# Altium schematic sheet 3_power.SchDoc
size A4; SheetNumber: 1; SheetTotal: 1
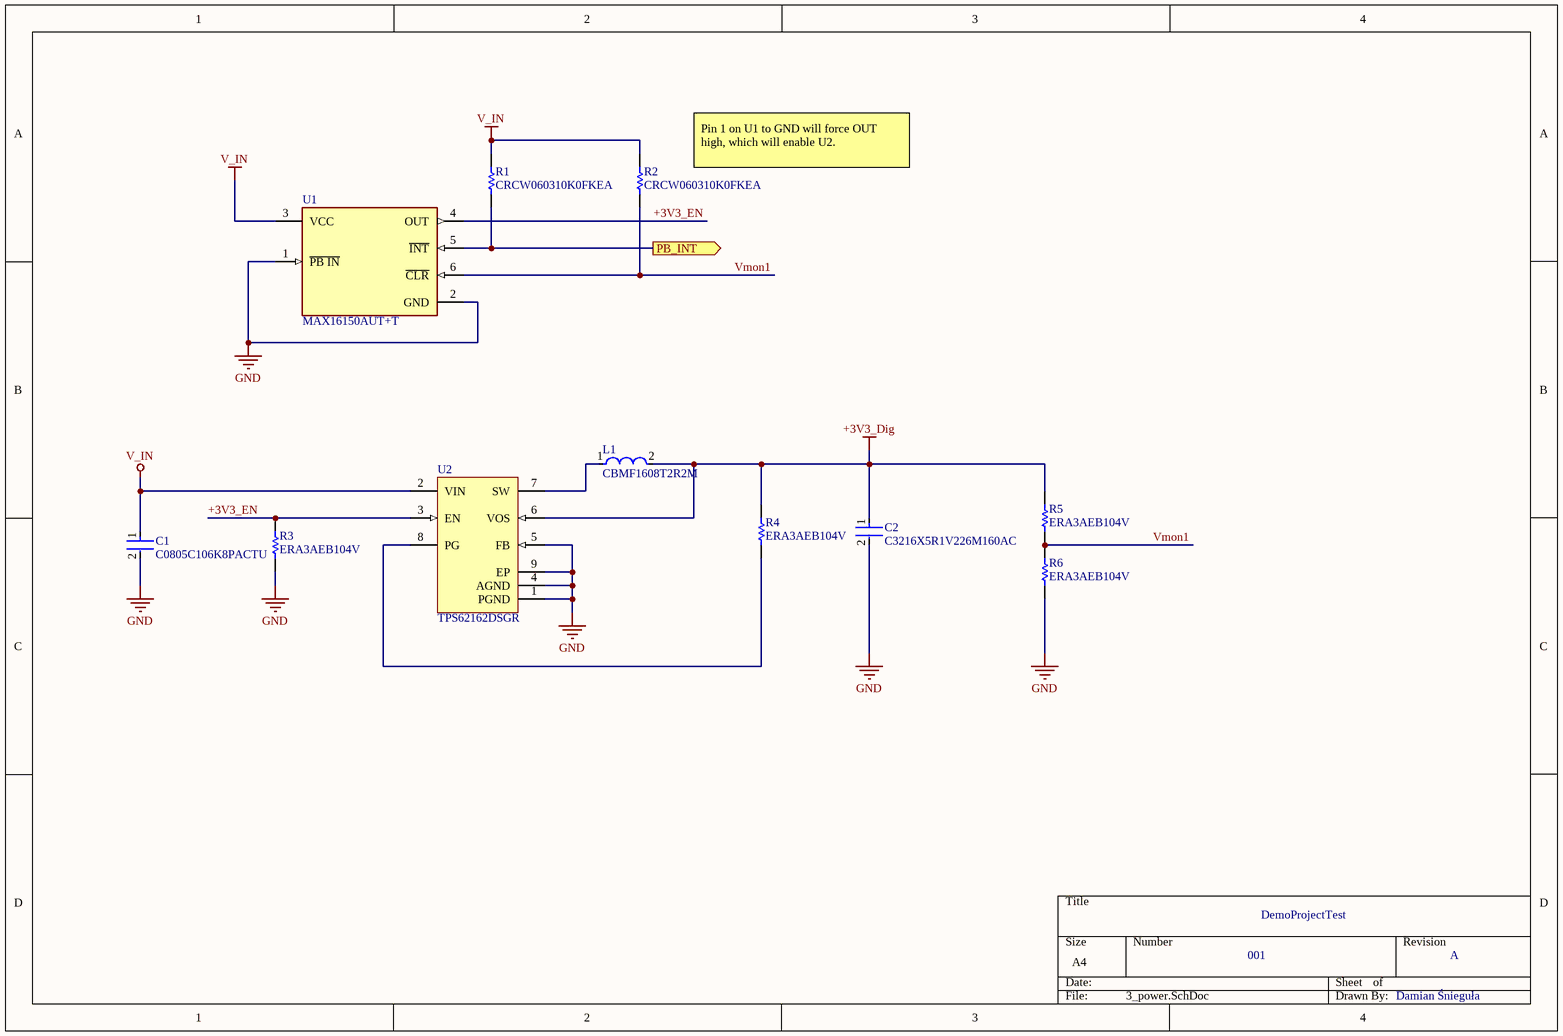
[diagram p0: 3_power.SchDoc]

## Parts
C1  C0805C106K8PACTU  [FP-C0805C-DG-MFG]
C2  C3216X5R1V226M160AC  [FP-C3216-160-0_2-IPC_B]
L1  CBMF1608T2R2M  [FP-CBMF1608-MFG]
R1  CRCW060310K0FKEA  [RESC1609X50X30NL8T20]
R2  CRCW060310K0FKEA  [RESC1609X50X30NL8T20]
R3  ERA3AEB104V  [RESC1608X55X30ML20T20]
R4  ERA3AEB104V  [RESC1608X55X30ML20T20]
R5  ERA3AEB104V  [RESC1608X55X30ML20T20]
R6  ERA3AEB104V  [RESC1608X55X30ML20T20]
U1  MAX16150AUT+T  [FP-U6-1-MFG]
U2  TPS62162DSGR  [DSG0008A_V]

## Ports
PB_INT (out)

## Nets
+3V3_Dig: C2.1 L1.2 R4.2 R5.2 U2.6(VOS)
GND: C1.2 C2.2 R3.1 R6.1 U1.1(~{PB_IN}) U1.2(GND) U2.1(PGND) U2.4(AGND) U2.5(FB) U2.9(EP)
V_IN: C1.1 R1.2 R2.2 U1.3(VCC) U2.2(VIN)
+3V3_EN: R3.2 U1.4(OUT) U2.3(EN)
PB_INT: R1.1 U1.5(~{INT}) ; port PB_INT
Vmon1: R2.1 R5.1 R6.2 U1.6(~{CLR})
NetL1_1: L1.1 U2.7(SW)
NetR4_1: R4.1 U2.8(PG)

## Notes on the sheet
- Pin 1 on U1 to GND will force OUT high, which will enable U2.
- DemoProjectTest
- 001
- A
- Damian Śnieguła

## Library data of the parts
C1 = CMP-2007-03243-2: CAP CER 10UF 10V X5R 0805; Manufacturer: Kemet; 3DS Part Number: 220-00001; Tolerance: 10%; Description: SMD Comm X5R, Ceramic, 10 uF, 10%, 10 V, X5R, SMD, MLCC, Temperature Stable, Class II, 0805; Temperature Coefficient: 15%; Material: Ceramic; Device Class L2: Capacitors; Device Class L1: Passive Components; ComponentLink2URL: https://content.kemet.com/datasheets/KEM_C1006_X5R_SMD.pdf; Height: 1.4mm; Lead Free: Yes; Manufacturer Part Number: C0805C106K8PACTU; Digikey Description: CAP CER 10UF 10V X5R 0805; Octopart: https://octopart.com/c0805c106k8pactu-kemet-98697; Capacitance: 10uF; Value: 10uF; Temperature Range Low: -55°C; Temperature: -55°C to +85°C; Automotive: No; Mouser Description: CAP CER 10UF 10V X5R 0805; Ipc Land Pattern Name: CAPC200125X125; Temperature Range High: +85°C; Voltage: 10V; RoHS: TRUE; Device Class L3: Ceramic Capacitors; ComponentLink2Description: Datasheet; Voltage Rating: 10V; Package: C0805C-DG; Temperature Characteristic: X5R; Category: Cap
C2 = CMP-2000-05398-2: Multilayer Ceramic Capacitors 22uF ±20% 35V X5R SMD 1206; Mount: Surface Mount; Voltage Rating: 35V; Length: 3.2mm; Case/Package: 1206; Width: 0.063inch; Dielectric Material: Ceramic; Series: C; Voltage Rating (DC): 35V; Construction: Flat; Tolerance: 20%; Dielectric: X5R; Voltage: 35V; Min Operating Temperature: -55°C; Case Code (Metric): 3216; Termination: SMD/SMT; Capacitance: 22uF; Resistor Type: Ceramic; RoHS Compliant: Yes; Height: 1.6mm; Depth: 1.6mm; Radiation Hardening: No; Package Quantity: 2000; REACH SVHC: No SVHC; Case Code (Imperial): 1206; Weight: 0.000571oz; Max Operating Temperature: 85°C; Packaging: Tape and Reel; Thickness: 1.6mm; Lead Free: Lead Free
L1 = CMP-14484-000379-1: SMD Inductors 2.2uH ±20% 0.56A 0.221Ω 0603; Core Material: Ferrite; Shielding: Unshielded; DC Resistance (DCR): 221mR; Current Rating: 560mA; Test Frequency: 7.96MHz; Saturation Current: 190mA; Self Resonant Frequency: 80MHz; Packaging: Tape and Reel; Tolerance: 20%; Width: 0.8mm; Length: 1.6mm; Min Operating Temperature: -40°C; RoHS Compliant: Yes; Halogen Free: Halogen Free; Height: 0.8mm; Package Quantity: 1; Mount: Surface Mount; Depth: 1mm; Height - Seated (Max): 0.039inch; Case Code (Metric): 1608; Series: CBMF; Termination: SMD/SMT; Case Code (Imperial): 0603; Military Standard: Not; Max DC Current: 560mA; Case/Package: 0603; Resistor Type: Wirewound; Radiation Hardening: No; Lead Free: Lead Free; Inductance Tolerance: 20%; DC Current: 560mA; Max Operating Temperature: 105°C; Inductance: 2.2uH
R1 R2 = CMP-1666-00005-4: Chip Resistor, 10 KOhm, +/- 1%, 100 mW, -55 to 155 degC, 0603 (1608 Metric), RoHS, Tape and Reel; Manufacturer: Vishay Semiconductor; Voltage Rating: 75 V; Max Operating Temperature: 155 degC; PackageDescription: 2-Pin Surface Mount Device, Body 1.575 x 0.85 mm; ComponentLink1Description: Manufacturer URL; RoHSCompliant: true; PackageReference: 0603; REACH SVHC: Unknown; Length: 1.55 mm; DatasheetVersion: 06/2012; Packaging: Tape and Reel; Min Operating Temperature: -55 degC; Mounting Technology: Surface Mount; ComponentLink2URL: https://datasheet.ciiva.com/11809/0900766b80d98afc-11809037.pdf; Height: 0.45 mm; ComponentLink2Description: Datasheet; Package Quantity: 5000; ComponentLink1URL: http://www.vishay.com/
R3-R6 = CMP-2000-00875-1: Manufacturer: Panasonic; Part Number: ERA3AEB104V
U1 = CMP-05723-001129-1: IC SUPERVISOR 1 CHANNEL SOT23-6
U2 = CMP-0323-00316-3: Buck Step Down Regulator with 3 to 17 V Input and 3.3 V Output, -40 to 85 degC, 8-Pin WSON (DSG), Green (RoHS & no Sb/Br); Manufacturer: Texas Instruments; SubFamily: Step-Down Regulator; Synchronous Rectification: TRUE; Vout(Max)(V): 3.3; Regulated Outputs(#): 1; Switch Current Limit(Typ)(A): 1.8; Duty Cycle(Max)(%): 100; Iq(Typ)(mA): 0.017; Rating: Catalog; Vin(Min)(V): 3; Vin(Max)(V): 17; ComponentLink2URL: http://www.ti.com/litv/pdf/mpds308a; ComponentLink3URL: Samples URL:http://www.ti.com/product/tps62162#samples; Eco-Plan: Green (RoHS & no Sb/Br); PackageDescription: 8-Pin Plastic Small Outline No-Lead, 2 x 2 x 0.8 mm Body, 0.5 mm Pitch, Exposed Pad; DatasheetVersion: SLVSAM2A; Topology: Buck; PartNumber: TPS62162DSGR; PackageReference: DSG0008A; ComponentLink1URL: http://www.ti.com/general/docs/lit/getliterature.tsp?genericPartNumber=TPS62162&fileType=pdf; PackageVersion: revB, Oct-2010; Mounting Technology: Surface Mount; Code_JEDEC: MO-229; Iout(Max)(A): 1; ComponentLink1Description: Datasheet; ComponentLink2Description: Package Specification; Vout(Min)(V): 3.3; ComponentLink3Description: URL Link1; Preset Vout(V): 3.3